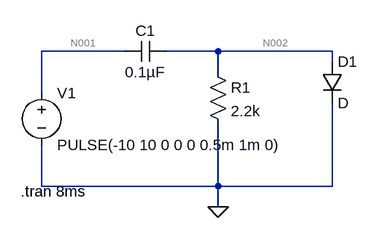
[diagram p0: schematic Clamper.asc]
Clamper.asc, the LTspice schematic file:
Version 4
SHEET 1 880 680
WIRE 48 80 -80 80
WIRE 192 80 112 80
WIRE 368 80 192 80
WIRE 368 96 368 80
WIRE 192 112 192 80
WIRE -80 144 -80 80
WIRE -80 288 -80 224
WIRE 192 288 192 192
WIRE 192 288 -80 288
WIRE 368 288 368 160
WIRE 368 288 192 288
WIRE 192 320 192 288
FLAG 192 320 0
SYMBOL diode 352 96 R0
SYMATTR InstName D1
SYMBOL cap 112 64 R90
WINDOW 0 0 32 VBottom 2
WINDOW 3 32 32 VTop 2
SYMATTR InstName C1
SYMATTR Value 0.1µF
SYMBOL res 176 96 R0
SYMATTR InstName R1
SYMATTR Value 2.2k
SYMBOL voltage -80 128 R0
WINDOW 123 0 0 Left 2
WINDOW 39 0 0 Left 2
SYMATTR InstName V1
SYMATTR Value PULSE(-10 10 0 0 0 0.5m 1m 0)
TEXT -112 296 Left 2 !.tran 8ms

The netlist it stands for:
* Clamper.asc
D1 N002 0 D
C1 N002 N001 0.1µF
R1 N002 0 2.2k
V1 N001 0 PULSE(-10 10 0 0 0 0.5m 1m 0)
.model D D
.lib standard.dio
.tran 8ms
.backanno
.end

* Results of the author's LTspice run, read from the files saved beside the schematic
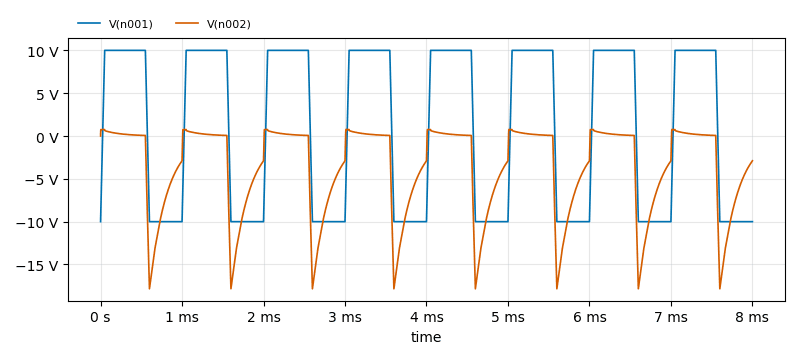
[diagram p1: Transient Analysis of Clamper.asc, plotted from the saved traces]
* Transient Analysis, 1 run:
*   V(n001): min -10 V, max 10 V, average 1 V, rms 9.709 V, last -10 V
*   V(n002): min -17.84 V, max 753.4 mV, average -3.62 V, rms 6.377 V, last -2.895 V